# Altium project ControllorBoardVer0.2.PrjPcb
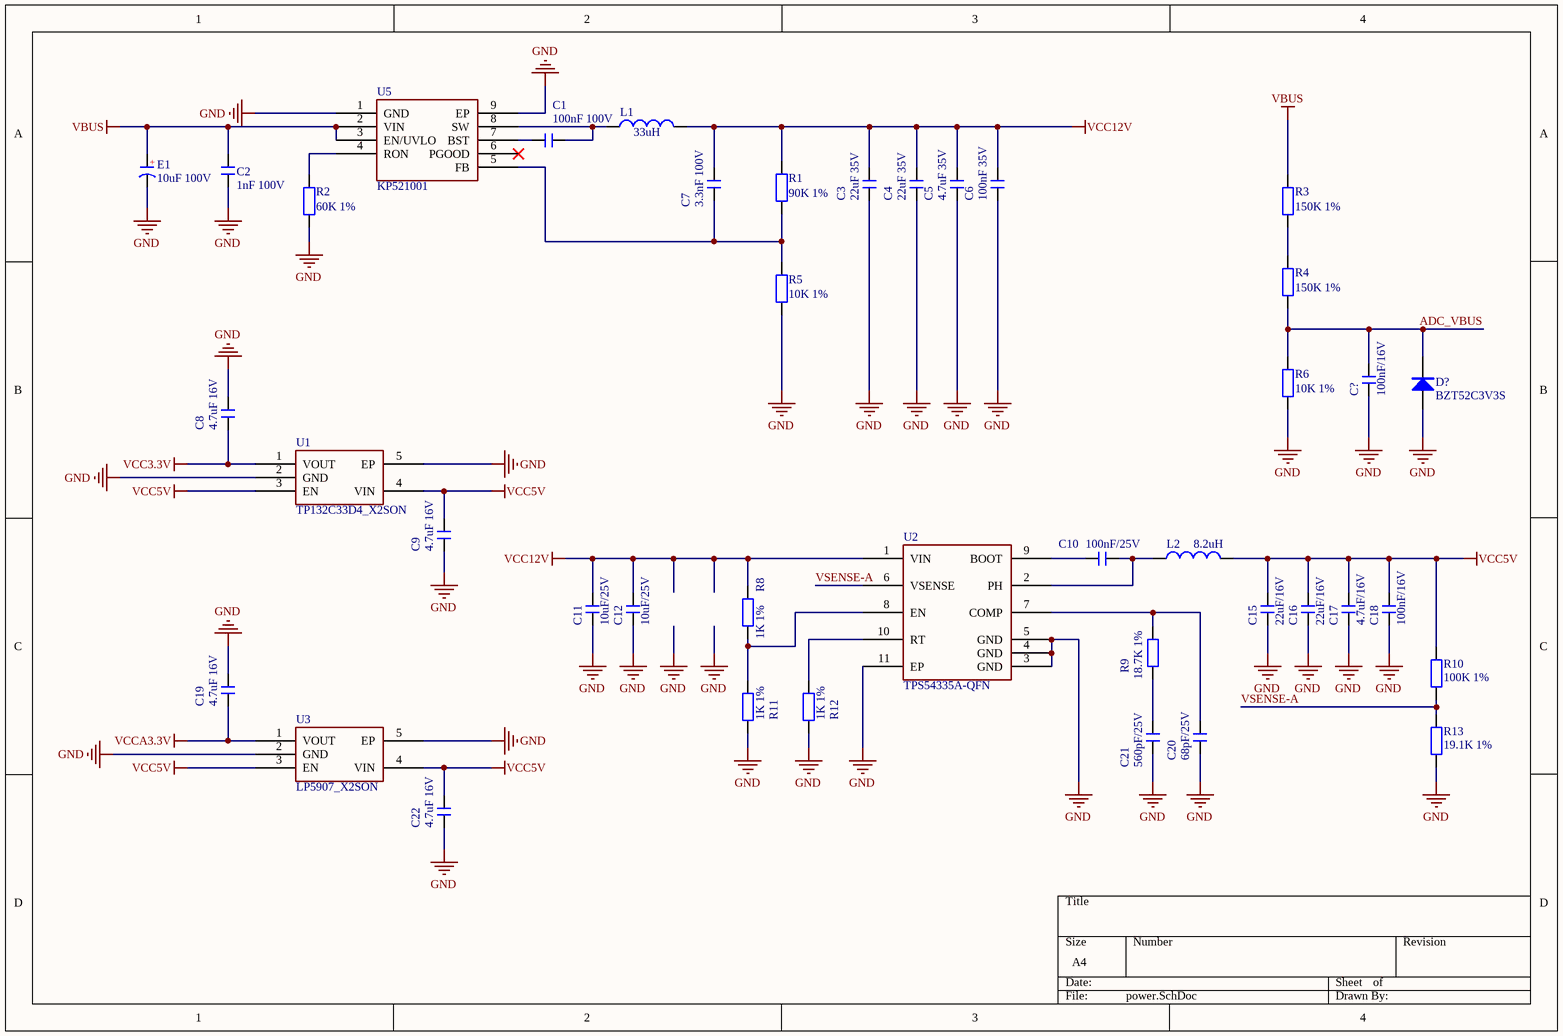
[diagram p0: power.SchDoc]
4 sheets, 165 parts. Net scope: global (net labels, ports and power ports of the same name join across sheets).
Board file: PCB.PcbDoc
Sheets:
  power.SchDoc
  mcu.SchDoc
  driver.SchDoc
  Connector.SchDoc

## Sheet power.SchDoc
size A4; SheetNumber: 1; SheetTotal: 4

### Parts
(Parts that share a designator on the sheet are numbered #1, #2 ... from top to bottom, then left to right.)
C1  100nF 100V  [C0603_L]
C2  1nF 100V  [C0603_L]
C3  22uF 35V  [C1206_L]
C4  22uF 35V  [C1206_L]
C5  4.7uF 35V  [C0603_L]
C6  100nF 35V  [C0603_L]
C7  3.3nF 100V  [C0603_L]
C8  4.7uF 16V  [C0603_L]
C9  4.7uF 16V  [C0603_L]
C10  100nF/25V  [c0603_l]
C11  10uF/25V  [C1206_L]
C12  10uF/25V  [C1206_L]
C15  22uF/16V  [C1206_l]
C16  22uF/16V  [C1206_l]
C17  4.7uF/16V  [c0603_l]
C18  100nF/16V  [c0603_l]
C19  4.7uF 16V  [C0603_L]
C20  68pF/25V  [c0603_l]
C21  560pF/25V  [c0603_l]
C22  4.7uF 16V  [C0603_L]
C?#1  100nF/16V  [c0603_l]
D?  BZT52C3V3S  [SOD-323]
E1  10uF 100V  [CT 6*4 - V]
L1  33uH  [NR6028]
L2  8.2uH  [NR4020]
R1  90K 1%  [R0603_l]
R2  60K 1%  [R0603_l]
R3  150K 1%  [R0603_l]
R4  150K 1%  [R0603_l]
R5  10K 1%  [R0603_l]
R6  10K 1%  [R0603_l]
R8  1K 1%  [R0603_l]
R9  18.7K 1%  [R0603_l]
R10  100K 1%  [R0603_l]
R11  1K 1%  [R0603_l]
R12  1K 1%  [R0603_l]
R13  19.1K 1%  [R0603_l]
U1  TP132C33D4_X2SON  [ZQFN-4L_L1.0-W1.0-P0.63-BL-EP]
U2  TPS54335A-QFN  [VSON-10_L3.0-W3.0-P0.50-TL-EP]
U3  LP5907_X2SON  [ZQFN-4L_L1.0-W1.0-P0.63-BL-EP]
U5  KP521001  [ESOP8_N]

### Nets
GND: C2.1 C3.1 C4.1 C5.1 C6.1 C8.2 C9.1 C11.1 C12.1 C15.1 C16.1 C17.1 C18.1 C19.2 C20.1 C21.1 C22.1 C?#1.1 D?.1(A) E1.2(K) R2.2 R5.2 R6.2 R11.2 R12.2 R13.2 U1.2(GND) U1.5(EP) U2.3(GND) U2.4(GND) U2.5(GND) U2.11(EP) U3.2(GND) U3.5(EP) U5.1(GND) U5.9(EP)
VBUS: C2.2 E1.1(A) R3.1 U5.2(VIN) U5.3(EN/UVLO)
VCC3.3V: C8.1 U1.1(VOUT)
VCC5V: C9.2 C15.2 C16.2 C17.2 C18.2 C22.2 L2.2 R10.1 U1.3(EN) U1.4(VIN) U3.3(EN) U3.4(VIN)
VCC12V: C3.2 C4.2 C5.2 C6.2 C7.2 C11.2 C12.2 L1.2 R1.1 R8.1 U2.1(VIN)
VCCA3.3V: C19.1 U3.1(VOUT)
ADC_VBUS: C?#1.2 D?.2(K) R4.2 R6.1
VSENSE-A: R10.2 R13.1 U2.6(VSENSE)
NetC1_1: C1.1 L1.1 U5.8(SW)
NetC1_2: C1.2 U5.7(BST)
NetC7_1: C7.1 R1.2 R5.1 U5.5(FB)
NetC10_1: C10.1 L2.1 U2.2(PH)
NetC10_2: C10.2 U2.9(BOOT)
NetC20_2: C20.2 R9.1 U2.7(COMP)
NetC21_2: C21.2 R9.2
NetR2_1: R2.1 U5.4(RON)
NetR3_2: R3.2 R4.1
NetR8_2: R8.2 R11.1 U2.8(EN)
NetR12_1: R12.1 U2.10(RT)

Not connected (* = marked no-connect by the designer): U5 6(PGOOD)*

### Notes on the sheet
- (in symbol C-CD) +

### Library data of the parts
C1-C9 C19 C22 = C-MLCC: 独石电容; 版权归属: 源创客; BOM名称: 独石电容; 学习资源: www.ooocke.com
C10-C12 C15-C18 C20 C21 C?#1 = C: 无极性贴片电容; 版权归属: 源创客; 材质: X7R; BOM名称: 无极性贴片电容; 学习资源: www.ooocke.com
D? = 1N4148: 高速开关二极管; 版权归属: 源创客; BOM名称: 高速开关二极管; 学习资源: www.ooocke.com
E1 = C-CD: 贴片钽电容; 版权归属: 源创客; BOM名称: 贴片钽电容; 学习资源: www.ooocke.com
L1 L2 = L: 小功率贴片电感; 版权归属: 源创客; BOM名称: 小功率贴片电感; 学习资源: www.ooocke.com
R1-R6 R8-R13 = R: 贴片电阻; 版权归属: 源创客; BOM名称: 贴片电阻; 学习资源: www.ooocke.com
U1 = TP132C33D4_X2SON: 与SOT-23-5符号不同！！！！！
U2 = TPS54335A-QFN: BUCK
U3 = LP5907_X2SON: 与SOT-23-5符号不同！！！！！
U5 = KP521001: DCDC降压芯片 最大电压100V 最大电流1A

## Sheet mcu.SchDoc
size A4; SheetNumber: 2; SheetTotal: 4
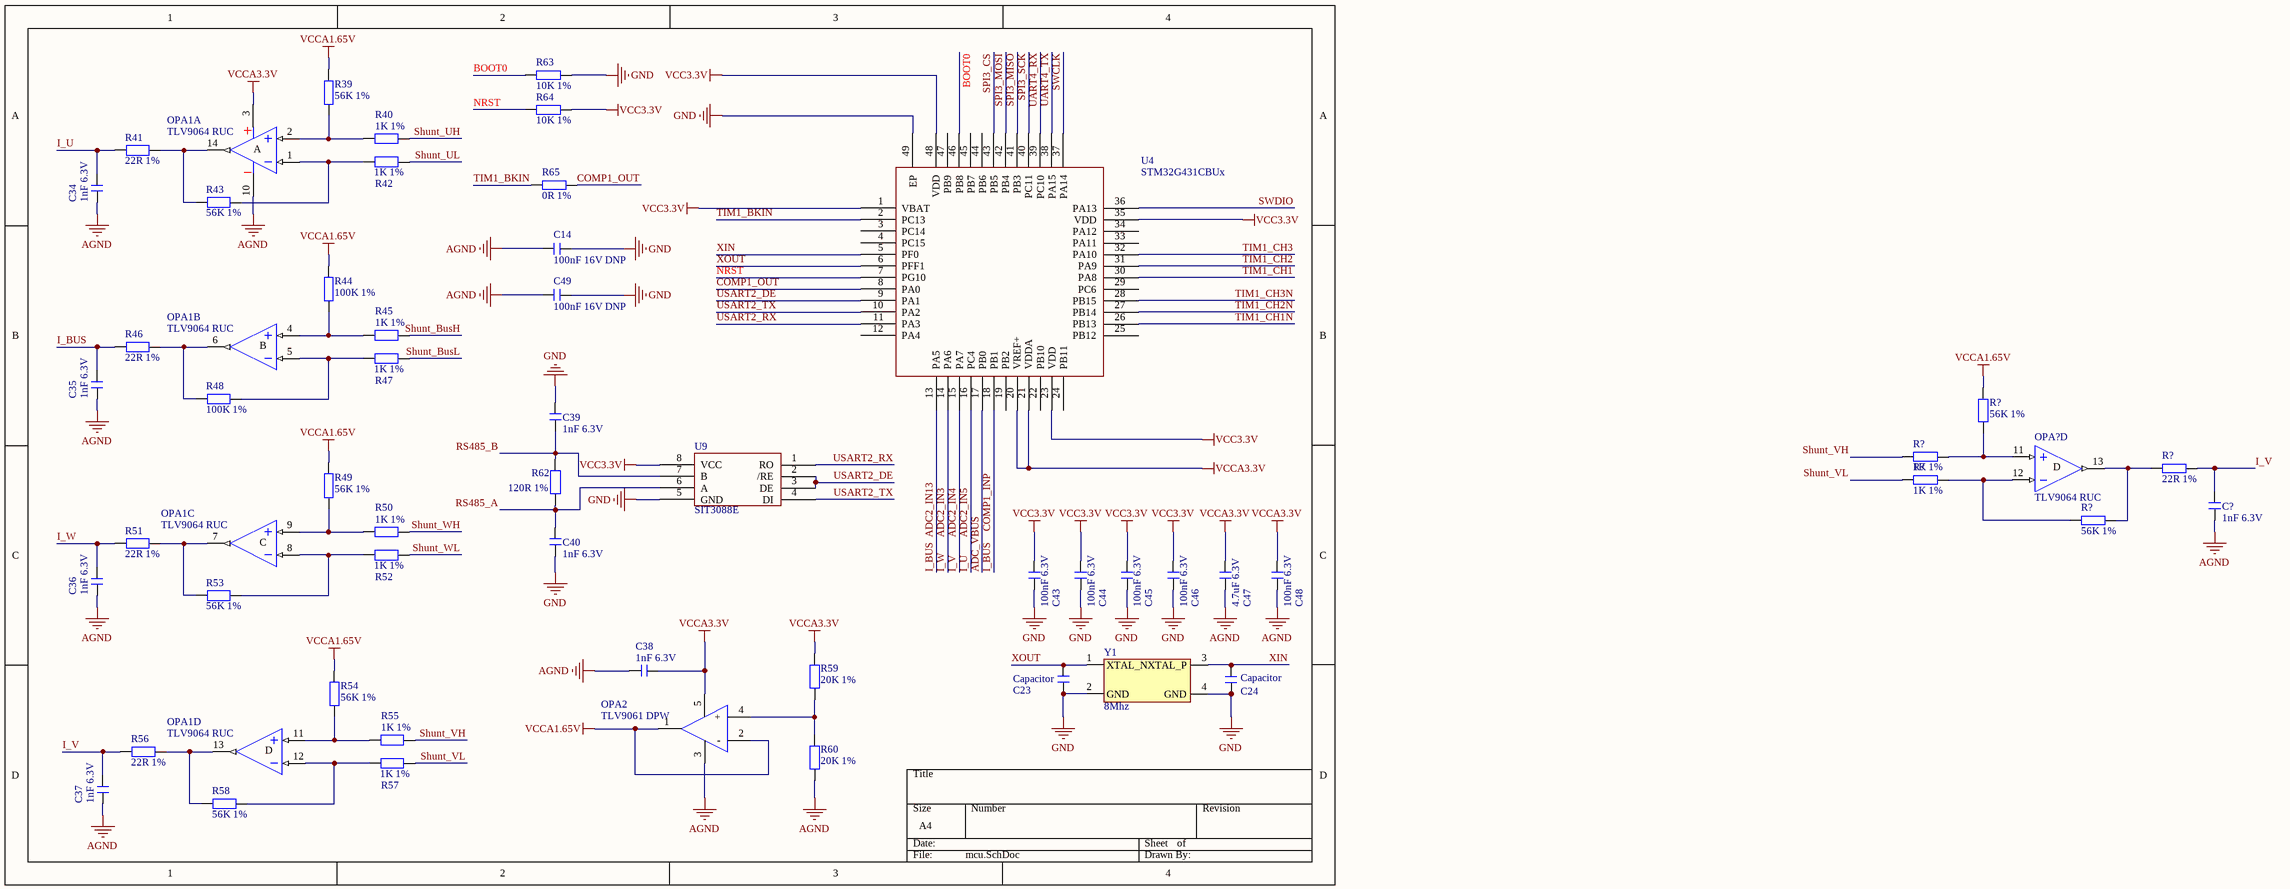
[diagram p1: mcu.SchDoc]

### Parts
(Parts that share a designator on the sheet are numbered #1, #2 ... from top to bottom, then left to right.)
C14  100nF 16V DNP  [C0603_L]
C23  Capacitor  [C0603_L]
C24  Capacitor  [C0603_L]
C34  1nF 6.3V  [C0603_L]
C35  1nF 6.3V  [C0603_L]
C36  1nF 6.3V  [C0603_L]
C37  1nF 6.3V  [C0603_L]
C38  1nF 6.3V  [C0603_L]
C39  1nF 6.3V  [C0603_L]
C40  1nF 6.3V  [C0603_L]
C43  100nF 6.3V  [C0603_L]
C44  100nF 6.3V  [C0603_L]
C45  100nF 6.3V  [C0603_L]
C46  100nF 6.3V  [C0603_L]
C47  4.7uF 6.3V  [C0603_L]
C48  100nF 6.3V  [C0603_L]
C49  100nF 16V DNP  [C0603_L]
C?#2  1nF 6.3V  [C0603_L]
OPA1  TLV9064 RUC  [TLV9064 RUC]  (parts A,B,C,D of 4)
OPA2  TLV9061 DPW  [X2SON-4_L0.8-W0.8-P0.48-TL-DPW]
OPA?  TLV9064 RUC  [TLV9064 RUC]  (part D of 4)
R39  56K 1%  [R0603_l]
R40  1K 1%  [R0603_l]
R41  22R 1%  [R0603_l]
R42  1K 1%  [R0603_l]
R43  56K 1%  [R0603_l]
R44  100K 1%  [R0603_l]
R45  1K 1%  [R0603_l]
R46  22R 1%  [R0603_l]
R47  1K 1%  [R0603_l]
R48  100K 1%  [R0603_l]
R49  56K 1%  [R0603_l]
R50  1K 1%  [R0603_l]
R51  22R 1%  [R0603_l]
R52  1K 1%  [R0603_l]
R53  56K 1%  [R0603_l]
R54  56K 1%  [R0603_l]
R55  1K 1%  [R0603_l]
R56  22R 1%  [R0603_l]
R57  1K 1%  [R0603_l]
R58  56K 1%  [R0603_l]
R59  20K 1%  [R0603_l]
R60  20K 1%  [R0603_l]
R62  120R 1%  [R0603_l]
R63  10K 1%  [R0603_l]
R64  10K 1%  [R0603_l]
R65  0R 1%  [R0603_l]
R?#1  56K 1%  [R0603_l]
R?#2  1K 1%  [R0603_l]
R?#3  22R 1%  [R0603_l]
R?#4  1K 1%  [R0603_l]
R?#5  56K 1%  [R0603_l]
U4  STM32G431CBUx  [QFN48 7X7_M]
U9  SIT3088E  [DFN-8_L3.0-W3.0-P0.65-BL-EP]
Y1  8Mhz  [OSC 3225-4P]

### Nets
AGND: C14.2 C34.1 C35.1 C36.1 C37.1 C38.1 C47.1 C48.1 C49.2 C?#2.1 OPA1.10(V-) OPA2.3(V-) R60.2
GND: C14.1 C23.2 C24.2 C39.2 C40.1 C43.1 C44.1 C45.1 C46.1 C49.1 R63.1 U4.49(EP) U9.5(GND) Y1.2(GND) Y1.4(GND)
VCC3.3V: C43.2 C44.2 C45.2 C46.2 R64.1 U4.1(VBAT) U4.23(VDD) U4.35(VDD) U4.48(VDD) U9.8(VCC)
VCCA1.65V: OPA2.1(OUT1) OPA2.2(-) R39.2 R44.2 R49.2 R54.2 R?#1.2
VCCA3.3V: C38.2 C47.2 C48.2 OPA1.3(V+) OPA2.5(V+) R59.1 U4.20(VREF+) U4.21(VDDA)
ADC2_IN3: C36.2 R51.1 U4.14(PA6)  [also labelled I_W]
ADC2_IN4: C37.2 C?#2.2 R56.1 R?#3.1 U4.15(PA7)  [also labelled I_V]
ADC2_IN5: C34.2 R41.1 U4.16(PC4)  [also labelled I_U]
ADC2_IN13: C35.2 R46.1 U4.13(PA5) U4.18(PB1)  [also labelled COMP1_INP, I_BUS]
ADC_VBUS: U4.17(PB0)
BOOT0: R63.2 U4.46(PB8)
COMP1_OUT: R65.1 U4.8(PA0)
NRST: R64.2 U4.7(PG10)
RS485_A: C40.2 R62.1 U9.6(A)
RS485_B: C39.1 R62.2 U9.7(B)
Shunt_BusH: R45.2
Shunt_BusL: R47.2
Shunt_UH: R40.2
Shunt_UL: R42.2
Shunt_VH: R55.2 R?#2.2
Shunt_VL: R57.2 R?#4.2
Shunt_WH: R50.2
Shunt_WL: R52.2
SPI3_CS: U4.43(PB5)
SPI3_MISO: U4.41(PB3)
SPI3_MOSI: U4.42(PB4)
SPI3_SCK: U4.40(PC11)
SWCLK: U4.37(PA14)
SWDIO: U4.36(PA13)
TIM1_BKIN: R65.2 U4.2(PC13)
TIM1_CH1: U4.30(PA8)
TIM1_CH1N: U4.26(PB13)
TIM1_CH2: U4.31(PA9)
TIM1_CH2N: U4.27(PB14)
TIM1_CH3: U4.32(PA10)
TIM1_CH3N: U4.28(PB15)
UART4_RX: U4.39(PC10)
UART4_TX: U4.38(PA15)
USART2_DE: U4.9(PA1) U9.2(/RE) U9.3(DE)
USART2_RX: U4.11(PA3) U9.1(RO)
USART2_TX: U4.10(PA2) U9.4(DI)
XIN: C24.1 U4.5(PF0) Y1.3(XTAL_P)
XOUT: C23.1 U4.6(PFF1) Y1.1(XTAL_N)
NetOPA1_1: OPA1.1(IN-) R42.1 R43.1
NetOPA1_2: OPA1.2(IN+) R39.1 R40.1
NetOPA1_4: OPA1.4(IN+) R44.1 R45.1
NetOPA1_5: OPA1.5(IN-) R47.1 R48.1
NetOPA1_6: OPA1.6(OUT) R46.2 R48.2
NetOPA1_7: OPA1.7(OUT) R51.2 R53.2
NetOPA1_8: OPA1.8(IN-) R52.1 R53.1
NetOPA1_9: OPA1.9(IN+) R49.1 R50.1
NetOPA1_11: OPA1.11(IN+) R54.1 R55.1
NetOPA1_12: OPA1.12(IN-) R57.1 R58.1
NetOPA1_13: OPA1.13(OUT) R56.2 R58.2
NetOPA1_14: OPA1.14(OUT) R41.2 R43.2
NetOPA2_4: OPA2.4(+) R59.2 R60.1
NetOPA?_11: OPA?.11(IN+) R?#1.1 R?#2.1
NetOPA?_12: OPA?.12(IN-) R?#4.1 R?#5.1
NetOPA?_13: OPA?.13(OUT) R?#3.2 R?#5.2

Not connected (* = marked no-connect by the designer): U4 3(PC14) 4(PC15) 12(PA4) 19(PB2) 22(PB10) 24(PB11) 25(PB12) 29(PC6) 33(PA11) 34(PA12) 44(PB6) 45(PB7) 47(PB9)

### Notes on the sheet
- (in symbol TLV9064 RUC, part A) A
- (in symbol TLV9064 RUC, part B) B
- (in symbol TLV9064 RUC, part C) C
- (in symbol TLV9064 RUC, part D) D

### Library data of the parts
C14 C34-C40 C43-C49 C?#2 = C-MLCC: 独石电容; 版权归属: 源创客; BOM名称: 独石电容; 学习资源: www.ooocke.com
C23 C24 = C: 无极性贴片电容; 版权归属: 源创客; 材质: X7R; BOM名称: 无极性贴片电容; 学习资源: www.ooocke.com
OPA1 OPA? = TLV9064 RUC: 4路运放 14 引脚 X2QFN; 版权归属: 源创客; BOM名称: 4路运放; 学习资源: www.ooocke.com
OPA2 = TLV9061 DPW: TLV9061 DPW单路运放
R39-R60 R62-R65 R?#1-R?#5 = R: 贴片电阻; 版权归属: 源创客; BOM名称: 贴片电阻; 学习资源: www.ooocke.com
U9 = SIT3088E: RS485/RS422收发器
Y1 = Crystal

## Sheet driver.SchDoc
size 320 x 199 mm; SheetNumber: 3; SheetTotal: 4
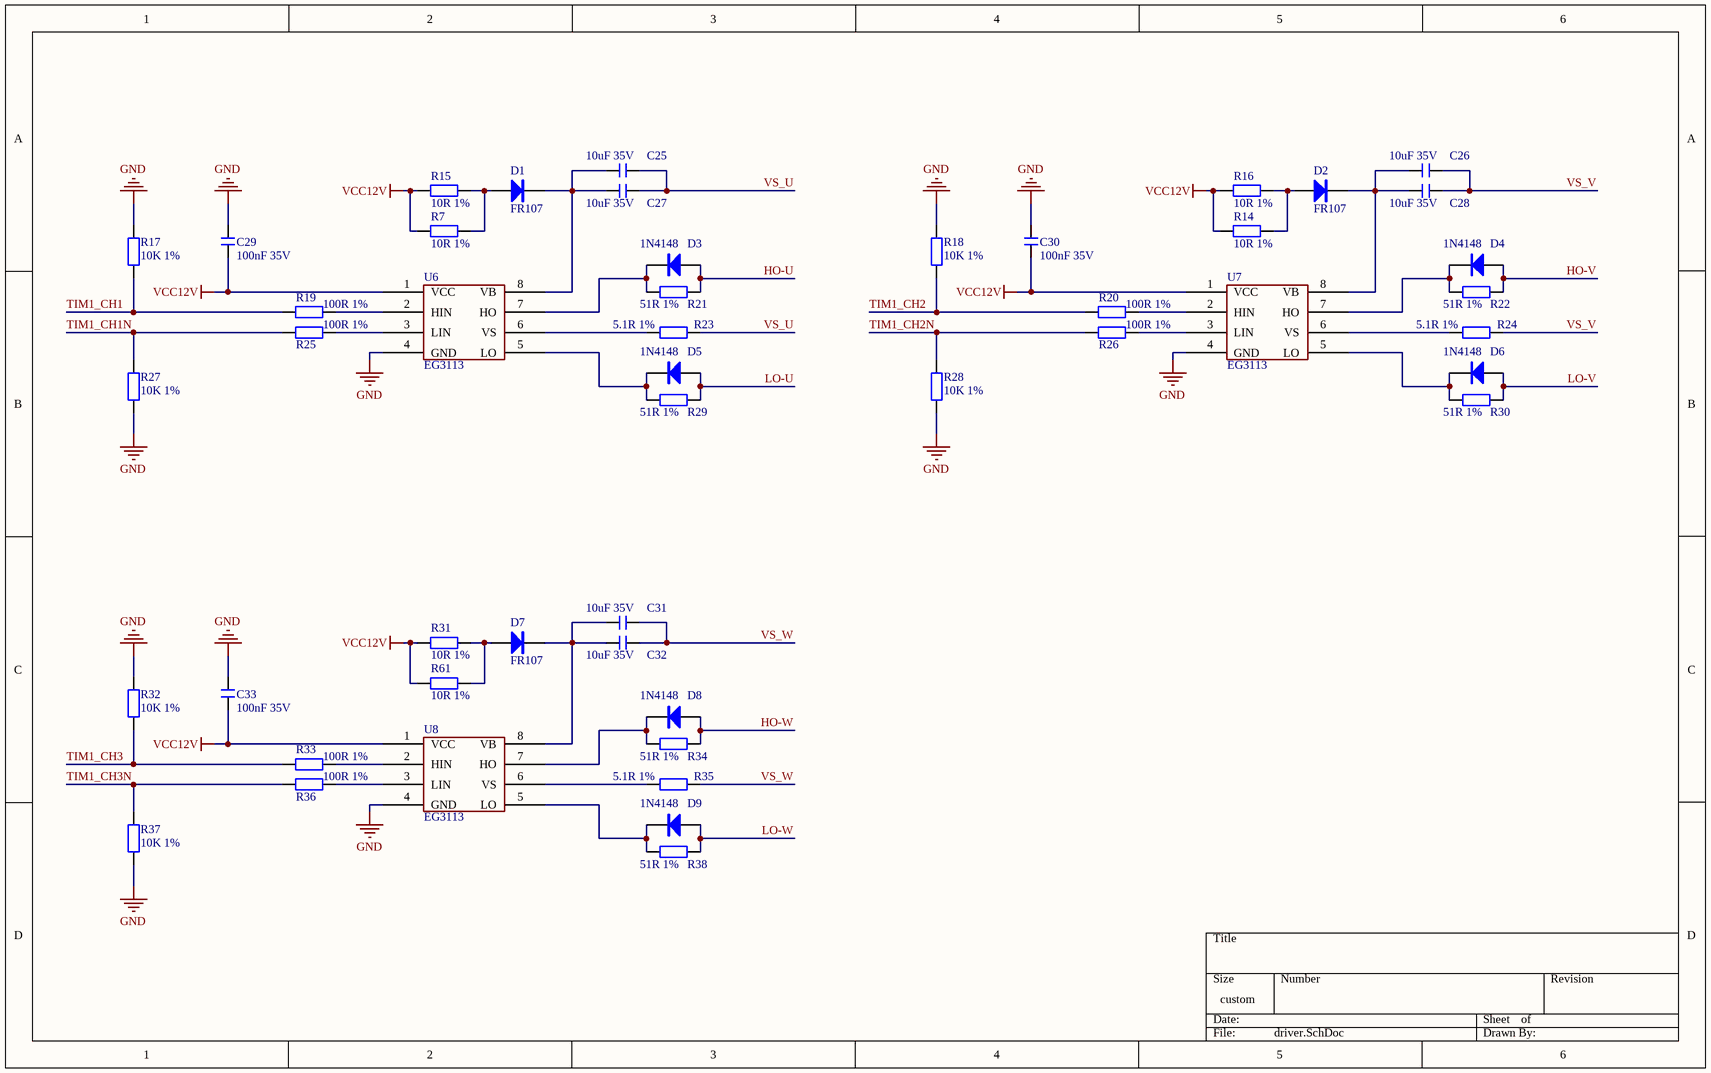
[diagram p2: driver.SchDoc]

### Parts
C25  10uF 35V  [C1206_L]
C26  10uF 35V  [C1206_L]
C27  10uF 35V  [C1206_L]
C28  10uF 35V  [C1206_L]
C29  100nF 35V  [C0603_L]
C30  100nF 35V  [C0603_L]
C31  10uF 35V  [C1206_L]
C32  10uF 35V  [C1206_L]
C33  100nF 35V  [C0603_L]
D1  FR107  [SOD-123]
D2  FR107  [SOD-123]
D3  1N4148  [SOD-323]
D4  1N4148  [SOD-323]
D5  1N4148  [SOD-323]
D6  1N4148  [SOD-323]
D7  FR107  [SOD-123]
D8  1N4148  [SOD-323]
D9  1N4148  [SOD-323]
R7  10R 1%  [R0603_l]
R14  10R 1%  [R0603_l]
R15  10R 1%  [R0603_l]
R16  10R 1%  [R0603_l]
R17  10K 1%  [R0603_l]
R18  10K 1%  [R0603_l]
R19  100R 1%  [R0603_l]
R20  100R 1%  [R0603_l]
R21  51R 1%  [R0603_l]
R22  51R 1%  [R0603_l]
R23  5.1R 1%  [R0603_l]
R24  5.1R 1%  [R0603_l]
R25  100R 1%  [R0603_l]
R26  100R 1%  [R0603_l]
R27  10K 1%  [R0603_l]
R28  10K 1%  [R0603_l]
R29  51R 1%  [R0603_l]
R30  51R 1%  [R0603_l]
R31  10R 1%  [R0603_l]
R32  10K 1%  [R0603_l]
R33  100R 1%  [R0603_l]
R34  51R 1%  [R0603_l]
R35  5.1R 1%  [R0603_l]
R36  100R 1%  [R0603_l]
R37  10K 1%  [R0603_l]
R38  51R 1%  [R0603_l]
R61  10R 1%  [R0603_l]
U6  EG3113  [SOP-8]
U7  EG3113  [SOP-8]
U8  EG3113  [SOP-8]

### Nets
GND: C29.1 C30.1 C33.1 R17.2 R18.2 R27.1 R28.1 R32.2 R37.1 U6.4(GND) U7.4(GND) U8.4(GND)
VCC12V: C29.2 C30.2 C33.2 R7.1 R14.1 R15.1 R16.1 R31.1 R61.1 U6.1(VCC) U7.1(VCC) U8.1(VCC)
HO-U: D3.1(A) R21.2
HO-V: D4.1(A) R22.2
HO-W: D8.1(A) R34.2
LO-U: D5.1(A) R29.2
LO-V: D6.1(A) R30.2
LO-W: D9.1(A) R38.2
TIM1_CH1: R17.1 R19.1
TIM1_CH1N: R25.1 R27.2
TIM1_CH2: R18.1 R20.1
TIM1_CH2N: R26.1 R28.2
TIM1_CH3: R32.1 R33.1
TIM1_CH3N: R36.1 R37.2
VS_U: C25.1 C27.1 R23.2
VS_V: C26.1 C28.1 R24.2
VS_W: C31.1 C32.1 R35.2
NetC25_2: C25.2 C27.2 D1.2(K) U6.8(VB)
NetC26_2: C26.2 C28.2 D2.2(K) U7.8(VB)
NetC31_2: C31.2 C32.2 D7.2(K) U8.8(VB)
NetD1_1: D1.1(A) R7.2 R15.2
NetD2_1: D2.1(A) R14.2 R16.2
NetD3_2: D3.2(K) R21.1 U6.7(HO)
NetD4_2: D4.2(K) R22.1 U7.7(HO)
NetD5_2: D5.2(K) R29.1 U6.5(LO)
NetD6_2: D6.2(K) R30.1 U7.5(LO)
NetD7_1: D7.1(A) R31.2 R61.2
NetD8_2: D8.2(K) R34.1 U8.7(HO)
NetD9_2: D9.2(K) R38.1 U8.5(LO)
NetR19_2: R19.2 U6.2(HIN)
NetR20_2: R20.2 U7.2(HIN)
NetR23_1: R23.1 U6.6(VS)
NetR24_1: R24.1 U7.6(VS)
NetR25_2: R25.2 U6.3(LIN)
NetR26_2: R26.2 U7.3(LIN)
NetR33_2: R33.2 U8.2(HIN)
NetR35_1: R35.1 U8.6(VS)
NetR36_2: R36.2 U8.3(LIN)

### Library data of the parts
C25-C33 = C: 无极性贴片电容; 版权归属: 源创客; 材质: X7R; BOM名称: 无极性贴片电容; 学习资源: www.ooocke.com
D1 D2 D7 = FR107: 快恢复整流二极管; BOM名称: 快恢复二极管; 版权归属: 源创客; 属性: 700V/1A; 学习资源: www.ooocke.com
D3-D6 D8 D9 = 1N4148: 高速开关二极管; 版权归属: 源创客; BOM名称: 高速开关二极管; 学习资源: www.ooocke.com
R7 R14-R38 R61 = R: 贴片电阻; 版权归属: 源创客; BOM名称: 贴片电阻; 学习资源: www.ooocke.com
U6-U8 = EG3113: 栅极驱动

## Sheet Connector.SchDoc
size A4; SheetNumber: 4; SheetTotal: 4
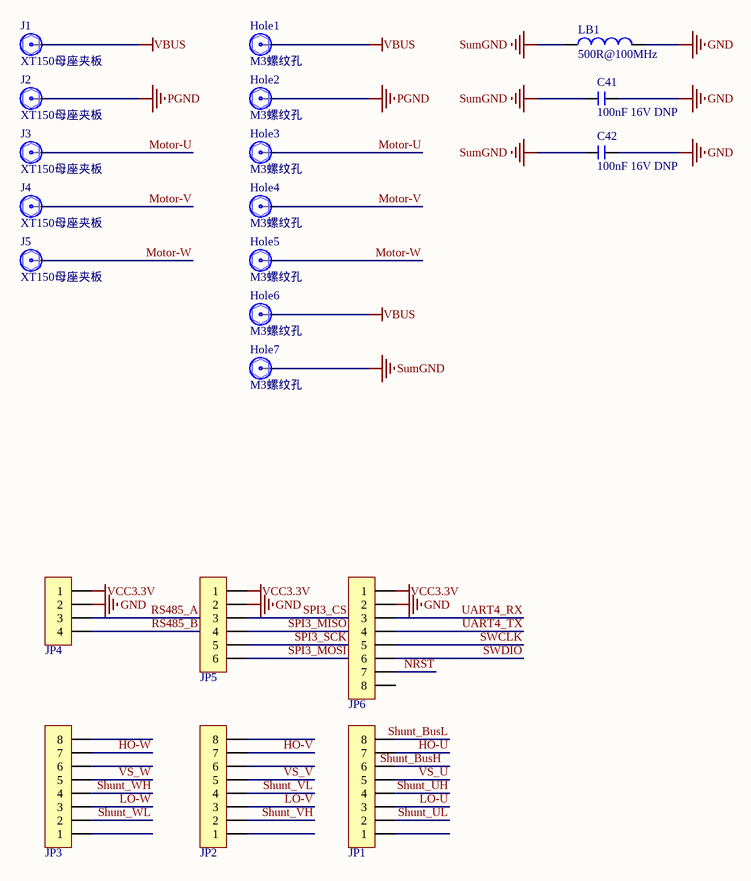
[diagram p3: Connector.SchDoc]

### Parts
C41  100nF 16V DNP  [C0603_L]
C42  100nF 16V DNP  [C0603_L]
Hole1  M3螺纹孔  [M3_3*7载流孔_铜柱]
Hole2  M3螺纹孔  [M3_3*7载流孔_铜柱]
Hole3  M3螺纹孔  [M3_3*7载流孔_螺丝]
Hole4  M3螺纹孔  [M3_3*7载流孔_螺丝]
Hole5  M3螺纹孔  [M3_3*7载流孔_螺丝]
Hole6  M3螺纹孔  [M3_3*7载流孔_铜柱]
Hole7  M3螺纹孔  [M3_3*7载流孔_铜柱]
J1  XT150母座夹板  [XT150_母座夹板 - VBUS]
J2  XT150母座夹板  [XT150_母座夹板 - PGND]
J3  XT150母座夹板  [XT150_母座夹板 - duplicate]
J4  XT150母座夹板  [XT150_母座夹板]
J5  XT150母座夹板  [XT150_母座夹板]
JP1  HDR-1X8  [贴片排母2.54mm_交错_8P - 正脚位]  (value not drawn)
JP2  HDR-1X8  [贴片排母2.54mm_交错_7P - 正脚位]  (value not drawn)
JP3  HDR-1X8  [贴片排母2.54mm_交错_7P - 正脚位]  (value not drawn)
JP4  HDR-1X4  [MX 1.25-WS-4P]  (value not drawn)
JP5  HDR-1X6  [MX 1.25-WS-6P]  (value not drawn)
JP6  HDR-1X8  [MX 1.25-WS-8P]  (value not drawn)
LB1  500R@100MHz  [FB 0805_L]

### Nets
GND: C41.1 C42.1 JP4.2 JP5.2 JP6.2 LB1.2
PGND: Hole2.1 J2.1
SumGND: C41.2 C42.2 Hole7.1 LB1.1
VBUS: Hole1.1 Hole6.1 J1.1
VCC3.3V: JP4.1 JP5.1 JP6.1
HO-U: JP1.7
HO-V: JP2.7
HO-W: JP3.7
LO-U: JP1.3
LO-V: JP2.3
LO-W: JP3.3
Motor-U: Hole3.1 J3.1
Motor-V: Hole4.1 J4.1
Motor-W: Hole5.1 J5.1
NRST: JP6.7
RS485_A: JP4.3
RS485_B: JP4.4
Shunt_BusH: JP1.6
Shunt_BusL: JP1.8
Shunt_UH: JP1.4
Shunt_UL: JP1.2
Shunt_VH: JP2.2
Shunt_VL: JP2.4
Shunt_WH: JP3.4
Shunt_WL: JP3.2
SPI3_CS: JP5.3
SPI3_MISO: JP5.4
SPI3_MOSI: JP5.6
SPI3_SCK: JP5.5
SWCLK: JP6.5
SWDIO: JP6.6
UART4_RX: JP6.3
UART4_TX: JP6.4
VS_U: JP1.5
VS_V: JP2.5
VS_W: JP3.5

Not connected (* = marked no-connect by the designer): JP1 1; JP2 1 6 8; JP3 1 6 8; JP6 8

### Library data of the parts
C41 C42 = C-MLCC: 独石电容; 版权归属: 源创客; BOM名称: 独石电容; 学习资源: www.ooocke.com
JP1-JP3 JP6 = Header 8: 8P接插件; 版权归属: 源创客; BOM名称: 8P接插件; 学习资源: www.ooocke.com
JP4 = Header 4: 4P接插件; 版权归属: 源创客; BOM名称: 4P接插件; 学习资源: www.ooocke.com
JP5 = Header 6: 6P接插件; 版权归属: 源创客; BOM名称: 6P接插件; 学习资源: www.ooocke.com
LB1 = LB: 磁珠; 版权归属: 源创客; BOM名称: 磁珠; 学习资源: www.ooocke.com

## Nets that join several sheets
GND: power (36 pins), mcu (15 pins), driver (12 pins), Connector (6 pins)
VBUS: power (5 pins), Connector (Hole1.1 Hole6.1 J1.1)
VCC3.3V: power (C8.1 U1.1), mcu (10 pins), Connector (JP4.1 JP5.1 JP6.1)
VCC12V: power (11 pins), driver (12 pins)
VCCA3.3V: power (C19.1 U3.1), mcu (8 pins)
ADC_VBUS: power (C?#1.2 D?.2 R4.2 R6.1), mcu (U4.17)
HO-U: driver (D3.1 R21.2), Connector (JP1.7)
HO-V: driver (D4.1 R22.2), Connector (JP2.7)
HO-W: driver (D8.1 R34.2), Connector (JP3.7)
LO-U: driver (D5.1 R29.2), Connector (JP1.3)
LO-V: driver (D6.1 R30.2), Connector (JP2.3)
LO-W: driver (D9.1 R38.2), Connector (JP3.3)
NRST: mcu (R64.2 U4.7), Connector (JP6.7)
RS485_A: mcu (C40.2 R62.1 U9.6), Connector (JP4.3)
RS485_B: mcu (C39.1 R62.2 U9.7), Connector (JP4.4)
Shunt_BusH: mcu (R45.2), Connector (JP1.6)
Shunt_BusL: mcu (R47.2), Connector (JP1.8)
Shunt_UH: mcu (R40.2), Connector (JP1.4)
Shunt_UL: mcu (R42.2), Connector (JP1.2)
Shunt_VH: mcu (R55.2 R?#2.2), Connector (JP2.2)
Shunt_VL: mcu (R57.2 R?#4.2), Connector (JP2.4)
Shunt_WH: mcu (R50.2), Connector (JP3.4)
Shunt_WL: mcu (R52.2), Connector (JP3.2)
SPI3_CS: mcu (U4.43), Connector (JP5.3)
SPI3_MISO: mcu (U4.41), Connector (JP5.4)
SPI3_MOSI: mcu (U4.42), Connector (JP5.6)
SPI3_SCK: mcu (U4.40), Connector (JP5.5)
SWCLK: mcu (U4.37), Connector (JP6.5)
SWDIO: mcu (U4.36), Connector (JP6.6)
TIM1_CH1: mcu (U4.30), driver (R17.1 R19.1)
TIM1_CH1N: mcu (U4.26), driver (R25.1 R27.2)
TIM1_CH2: mcu (U4.31), driver (R18.1 R20.1)
TIM1_CH2N: mcu (U4.27), driver (R26.1 R28.2)
TIM1_CH3: mcu (U4.32), driver (R32.1 R33.1)
TIM1_CH3N: mcu (U4.28), driver (R36.1 R37.2)
UART4_RX: mcu (U4.39), Connector (JP6.3)
UART4_TX: mcu (U4.38), Connector (JP6.4)
VS_U: driver (C25.1 C27.1 R23.2), Connector (JP1.5)
VS_V: driver (C26.1 C28.1 R24.2), Connector (JP2.5)
VS_W: driver (C31.1 C32.1 R35.2), Connector (JP3.5)